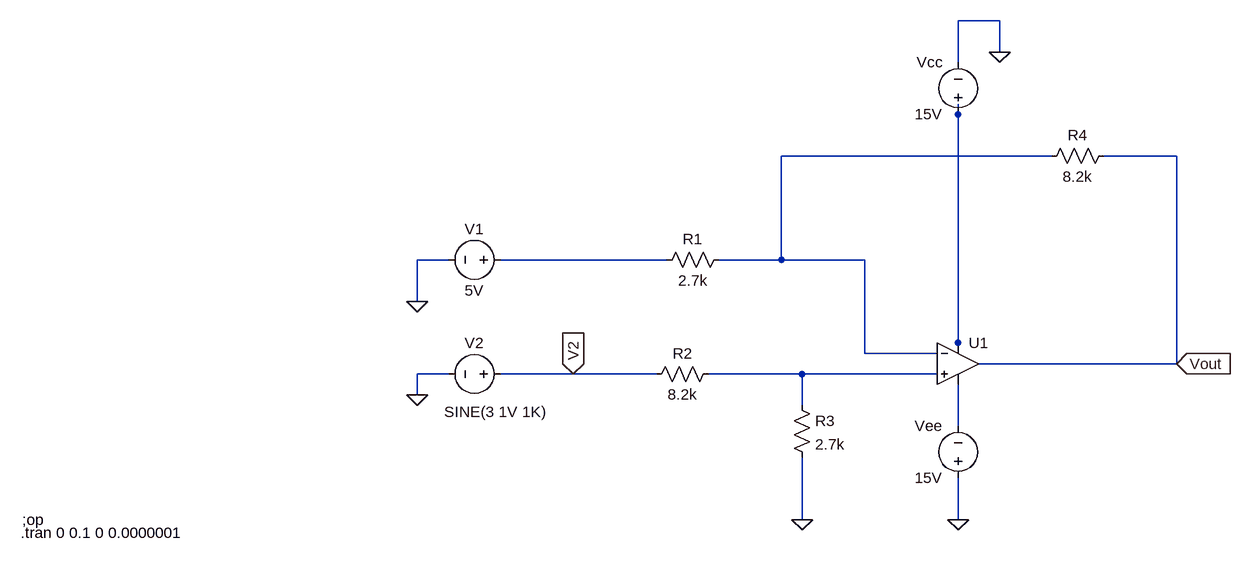
[diagram p0: schematic substractor opamp circuit.asc]
substractor opamp circuit.asc, the LTspice schematic file:
Version 4
SHEET 1 880 680
WIRE 496 -336 432 -336
WIRE 496 -288 496 -336
WIRE 432 -272 432 -336
WIRE 432 -192 432 -208
WIRE 576 -128 160 -128
WIRE 768 -128 656 -128
WIRE -352 32 -400 32
WIRE -16 32 -272 32
WIRE 160 32 160 -128
WIRE 160 32 64 32
WIRE 288 32 160 32
WIRE -400 96 -400 32
WIRE 432 160 432 -192
WIRE 288 176 288 32
WIRE 400 176 288 176
WIRE 432 176 432 160
WIRE 768 192 768 -128
WIRE 768 192 464 192
WIRE -352 208 -400 208
WIRE -160 208 -272 208
WIRE -32 208 -160 208
WIRE 192 208 48 208
WIRE 400 208 192 208
WIRE -400 240 -400 208
WIRE 192 256 192 208
WIRE 432 288 432 224
WIRE 192 432 192 336
WIRE 432 432 432 368
FLAG 432 432 0
FLAG 496 -288 0
FLAG -400 240 0
FLAG -400 96 0
FLAG -160 208 V2
IOPIN -160 208 In
FLAG 768 192 Vout
IOPIN 768 192 In
FLAG 192 432 0
SYMBOL res 80 16 R90
WINDOW 0 0 56 VBottom 2
WINDOW 3 32 56 VTop 2
SYMATTR InstName R1
SYMATTR Value 2.7k
SYMBOL res 64 192 R90
WINDOW 0 0 56 VBottom 2
WINDOW 3 32 56 VTop 2
SYMATTR InstName R2
SYMATTR Value 8.2k
SYMBOL res 672 -144 R90
WINDOW 0 0 56 VBottom 2
WINDOW 3 32 56 VTop 2
SYMATTR InstName R4
SYMATTR Value 8.2k
SYMBOL voltage 432 -176 R180
WINDOW 0 24 96 Left 2
WINDOW 3 24 16 Left 2
WINDOW 123 0 0 Left 0
WINDOW 39 0 0 Left 0
SYMATTR InstName Vcc
SYMATTR Value 15V
SYMBOL voltage 432 384 R180
WINDOW 0 24 96 Left 2
WINDOW 3 24 16 Left 2
WINDOW 123 0 0 Left 0
WINDOW 39 0 0 Left 0
SYMATTR InstName Vee
SYMATTR Value 15V
SYMBOL Opamps\\UniversalOpamp2 432 192 R0
SYMATTR InstName U1
SYMBOL voltage -256 32 R90
WINDOW 0 -32 56 VBottom 2
WINDOW 3 32 56 VTop 2
WINDOW 123 0 0 Left 0
WINDOW 39 0 0 Left 0
SYMATTR InstName V1
SYMATTR Value 5V
SYMBOL voltage -256 208 R90
WINDOW 0 -32 56 VBottom 2
WINDOW 3 43 24 VTop 2
WINDOW 123 0 0 Left 0
WINDOW 39 0 0 Left 0
SYMATTR InstName V2
SYMATTR Value SINE(3 1V 1K)
SYMBOL res 176 240 R0
SYMATTR InstName R3
SYMATTR Value 2.7k
TEXT -1008 432 Left 2 !;op
TEXT -1010 452 Left 2 !.tran 0 0.1 0 0.0000001

The netlist it stands for:
* substractor opamp circuit.asc
R1 N002 N003 2.7k
R2 N004 V2 8.2k
R4 Vout N002 8.2k
Vcc N001 0 15V
Vee 0 N005 15V
XU1 N004 N002 N001 N005 Vout level.2 Avol=1Meg GBW=10Meg Slew=10Meg ilimit=25m rail=0 Vos=0 phimargin=45 en=0 enk=0 in=0 ink=0 Rin=500Meg  ; pins IN+ IN- V+ V- OUT
V1 N003 0 5V
V2 V2 0 SINE(3 1V 1K)
R3 N004 0 2.7k
;op
.tran 0 0.1 0 0.0000001
.lib UniversalOpamps2.sub
.backanno
.end